# Altium schematic sheet Sheet4.SchDoc
size A4; SheetNumber: 4; SheetTotal: 5
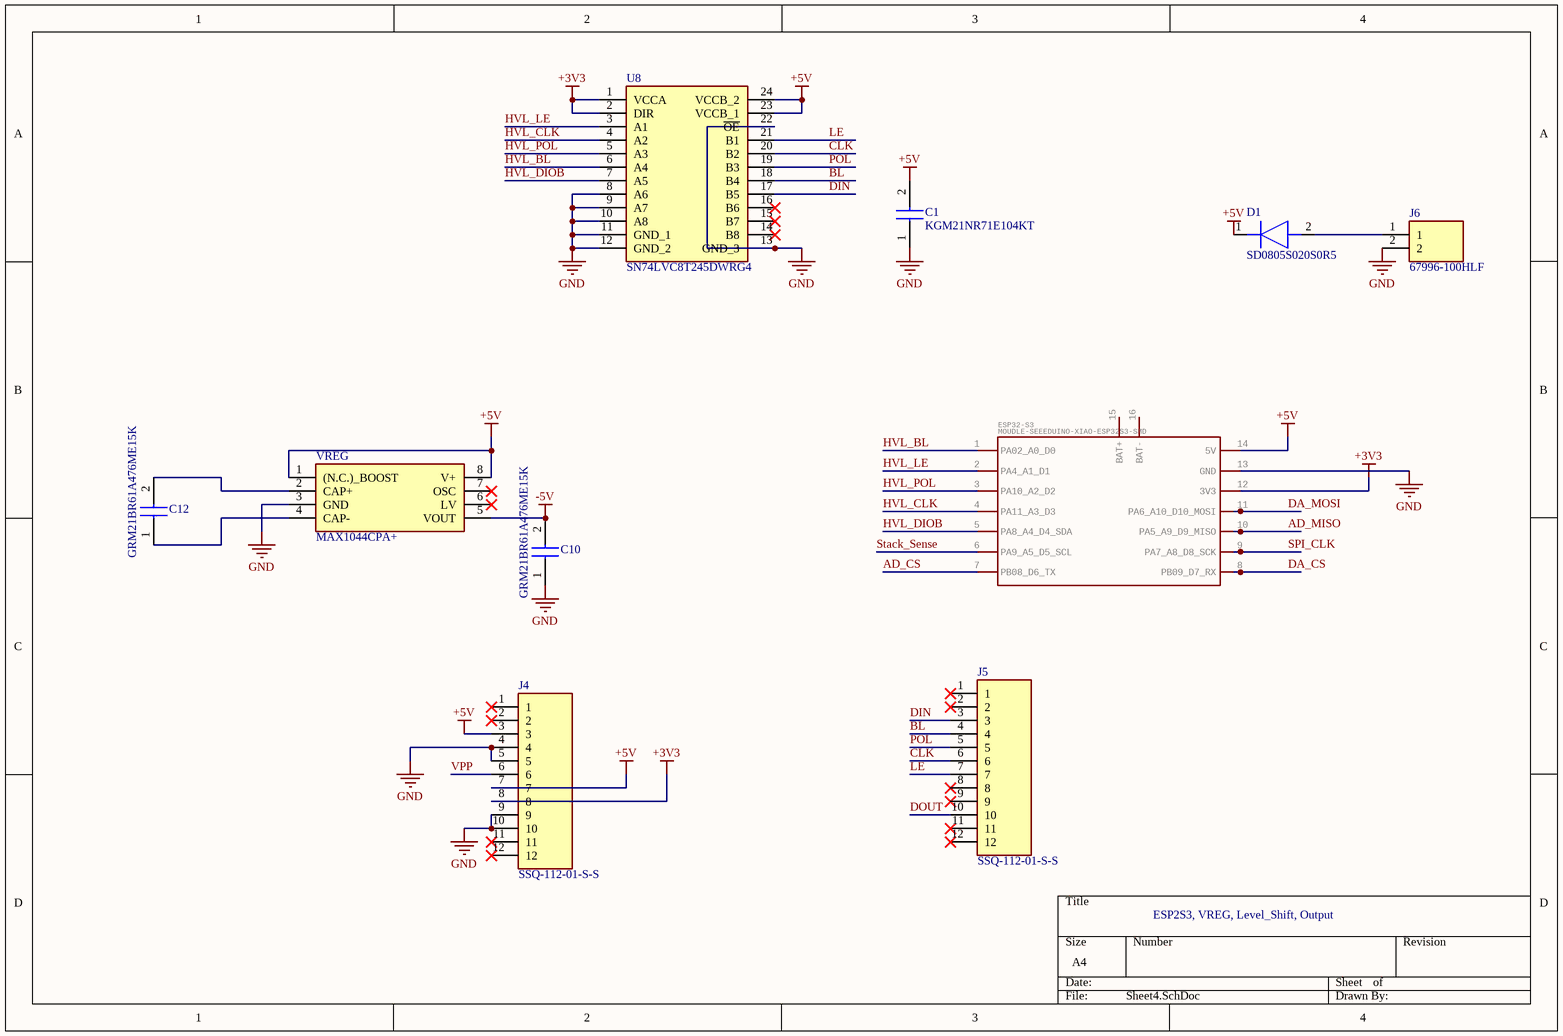
[diagram p0: Sheet4.SchDoc]

## Parts
C1  KGM21NR71E104KT  [CAPC2012X100N]
C10  GRM21BR61A476ME15K  [CAPC2012X100N]
C12  GRM21BR61A476ME15K  [CAPC2012X100N]
D1  SD0805S020S0R5  [DIOC2013X100N]
ESP32-S3  MOUDLE-SEEEDUINO-XIAO-ESP32S3-SMD  [MOUDLE14P-2-54-21X17-8MM]
J4  SSQ-112-01-S-S  [RHDR12W64P254_1X12_3099X241X851P]
J5  SSQ-112-01-S-S  [RHDR12W64P254_1X12_3099X241X851P]
J6  67996-100HLF  [HDRV2W67P254_2X1_254X483X858P]
U8  SN74LVC8T245DWRG4  [SOIC127P1030X265-24N]
VREG  MAX1044CPA+  [DIP794W56P254L938H457Q8N]

## Nets
+3V3: ESP32-S3.12(3V3) J4.8 U8.1(VCCA) U8.2(DIR)
+5V: C1.2 D1.1(K) ESP32-S3.14(5V) J4.3 J4.7 U8.23(VCCB_1) U8.24(VCCB_2) VREG.1((N.C.)_BOOST) VREG.8(V+)
-5V: C10.2 VREG.5(VOUT)
GND: C1.1 C10.1 ESP32-S3.13(GND) J4.4 J4.5 J4.9 J4.10 J6.2 U8.8(A6) U8.9(A7) U8.10(A8) U8.11(GND_1) U8.12(GND_2) U8.13(GND_3) U8.22(~{OE}) VREG.3(GND)
AD_CS: ESP32-S3.7(PB08_D6_TX)
AD_MISO: ESP32-S3.10(PA5_A9_D9_MISO)
BL: J5.4 U8.18(B4)
CLK: J5.6 U8.20(B2)
DA_CS: ESP32-S3.8(PB09_D7_RX)
DA_MOSI: ESP32-S3.11(PA6_A10_D10_MOSI)
DIN: J5.3 U8.17(B5)
DOUT: J5.10
HVL_BL: ESP32-S3.1(PA02_A0_D0) U8.6(A4)
HVL_CLK: ESP32-S3.4(PA11_A3_D3) U8.4(A2)
HVL_DIOB: ESP32-S3.5(PA8_A4_D4_SDA) U8.7(A5)
HVL_LE: ESP32-S3.2(PA4_A1_D1) U8.3(A1)
HVL_POL: ESP32-S3.3(PA10_A2_D2) U8.5(A3)
LE: J5.7 U8.21(B1)
POL: J5.5 U8.19(B3)
SPI_CLK: ESP32-S3.9(PA7_A8_D8_SCK)
Stack_Sense: ESP32-S3.6(PA9_A5_D5_SCL)
VPP: J4.6
NetC12_1: C12.1 VREG.4(CAP-)
NetC12_2: C12.2 VREG.2(CAP+)
NetD1_2: D1.2(A) J6.1

Not connected (* = marked no-connect by the designer): ESP32-S3 15(BAT+) 16(BAT-); J4 1* 2* 11* 12*; J5 1* 2* 8* 9* 11* 12*; U8 14(B8)* 15(B7)* 16(B6)*; VREG 6(LV)* 7(OSC)*

## Notes on the sheet
- ESP2S3, VREG, Level_Shift, Output

## Library data of the parts
C1 C10 C12 = KGM21NR71E104KT: Capacitor; Manufacturer_Name: KYOCERA; Datasheet Link: https://spicat.kyocera-avx.com/product/mlcc/chartview/KGM21NR71E104KT/DataSheet/X7R; Height: 1mm; Manufacturer_Part_Number: KGM21NR71E104KT; Mouser Part Number: 581-KGM21NR71E104KT; Mouser Price/Stock: https://www.mouser.co.uk/ProductDetail/KYOCERA-AVX/KGM21NR71E104KT?qs=OcgtsXO%252B3gt5l3KgnBGsBw%3D%3D
D1 = SD0805S020S0R5: Diode; Manufacturer_Name: AVX; Datasheet Link: https://datasheets.kyocera-avx.com/schottky.pdf; Height: 1mm; Manufacturer_Part_Number: SD0805S020S0R5; Mouser Part Number: 581-SD0805S020S0R5; Mouser Price/Stock: https://www.mouser.co.uk/ProductDetail/AVX/SD0805S020S0R5?qs=jCA%252BPfw4LHZ%252BeTNuLGlRmA%3D%3D; Arrow Part Number: SD0805S020S0R5; Arrow Price/Stock: https://www.arrow.com/en/products/sd0805s020s0r5/avx
ESP32-S3 = MOUDLE-SEEEDUINO-XIAO-ESP32S3-SMD: GateName_1: G$1; DeviceName: -SMD; SymbolName_1: MOUDLE-SEEEDUINO-XIAO-ESP32S3; LibraryName: Seeed-Studio-XIAO-ESP32S3-footprint-eagle (1); DeviceSetName: MOUDLE-SEEEDUINO-XIAO-ESP32S3; Package: MOUDLE14P-SMD-2.54-21X17.8MM
J4 J5 = SSQ-112-01-S-S: 12 Position, .100&quot; Tiger Buy&trade; Socket Strip, Square Tail, Single Row; Manufacturer_Name: SAMTEC; Geometry.Height: 8.51mm; Mouser Part Number: 200-SSQ11201SS; Mouser Price/Stock: https://www.mouser.co.uk/ProductDetail/Samtec/SSQ-112-01-S-S?qs=rU5fayqh%252BE2QzWr5YZvwlg%3D%3D; Manufacturer_Part_Number: SSQ-112-01-S-S; Datasheet Link: http://suddendocs.samtec.com/prints/ssq-1xx-xx-xxx-x-xx-xxx-xx-x-mkt.pdf
J6 = 67996-100HLF: BergStik<sup>&reg;</sup>, Board to Board connector, Unshrouded vertical header, Through Hole, Double Row, 0 Positions, 2.54 mm (0.100in) Pitch; Manufacturer_Name: Amphenol Communications Solutions; Geometry.Height: 8.58mm; Mouser Part Number: *; Mouser Price/Stock: *; Manufacturer_Part_Number: 67996-100HLF; Datasheet Link: https://cdn.amphenol-cs.com/media/wysiwyg/files/drawing/67996.pdf
U8 = SN74LVC8T245DWRG4: Integrated Circuit; Manufacturer_Name: Texas Instruments; Datasheet Link: https://www.ti.com/lit/ds/symlink/sn74lvc8t245.pdf?HQS=dis-mous-null-mousermode-dsf-pf-null-wwe&ts=1634017408133&ref_url=https%253A%252F%252Fcz.mouser.com%252F; Height: 2.65mm; Manufacturer_Part_Number: SN74LVC8T245DWRG4; Mouser Part Number: 595-74LVC8T245DWRG4; Mouser Price/Stock: https://www.mouser.co.uk/ProductDetail/Texas-Instruments/SN74LVC8T245DWRG4?qs=l4wu3mKjyfn59yca0qzZ1Q%3D%3D; Arrow Part Number: SN74LVC8T245DWRG4; Arrow Price/Stock: https://www.arrow.com/en/products/sn74lvc8t245dwrg4/texas-instruments
VREG = MAX1044CPA+: Power Supply; Manufacturer_Name: Analog Devices; Datasheet Link: https://datasheets.maximintegrated.com/en/ds/ICL7660-MAX1044.pdf; Height: 4.572mm; Manufacturer_Part_Number: MAX1044CPA+; Mouser Part Number: 700-MAX1044CPA; Mouser Price/Stock: https://www.mouser.co.uk/ProductDetail/Analog-Devices-Maxim-Integrated/MAX1044CPA%2b?qs=0Y9aZN%252BMVCXfHpZN39Twfg%3D%3D; Arrow Part Number: MAX1044CPA+; Arrow Price/Stock: https://www.arrow.com/en/products/max1044cpa/maxim-integrated?region=nac